# EasyEDA schematic SCH_FILTER_SOL_01_2025-06-17.json
TITLE: PUMP-FP-101_SCH; REV: 1.0; Date: 2025-04-23; Sheet: 1/1; Drawn By: aamirf; Company: FARMINCLOUD
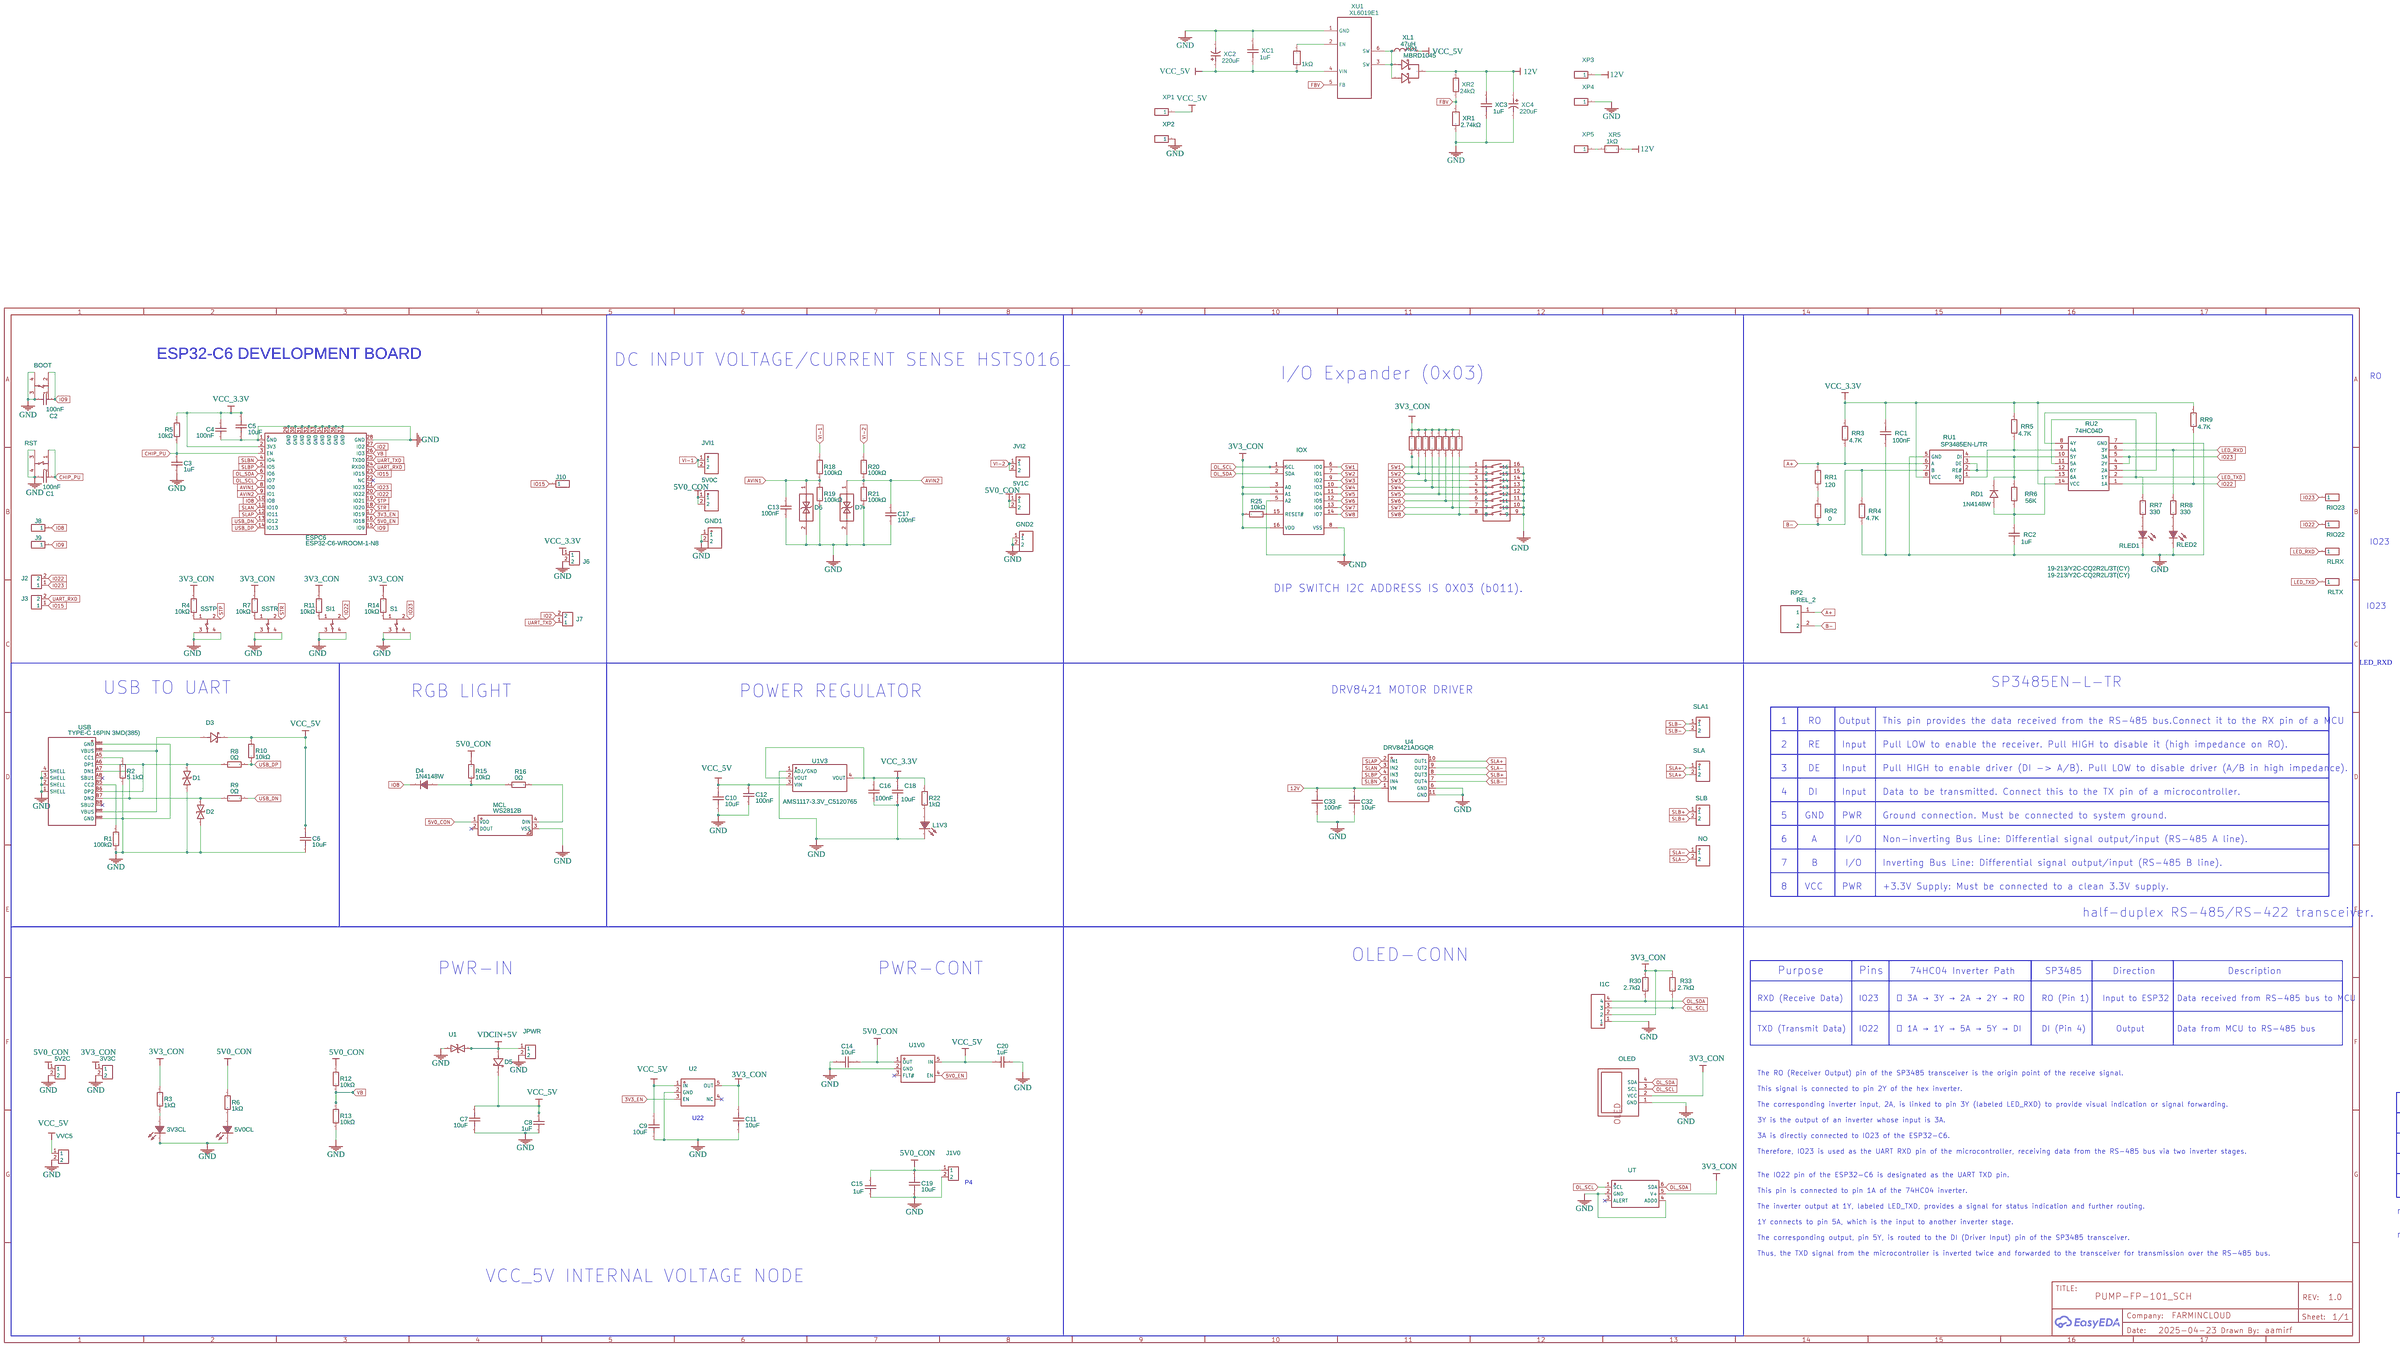
[diagram p0: schematic sheet]

## Parts
3V3C  HD_1X2_2.54  [HDR-TH_2P-P2.54]
3V3CL  KT-0603R  [LED0603-RD]
5V0C  2060-451/998-404  [CONN-SMD_L12.7-W3.9_2060-451-998-404]
5V0CL  KT-0603R  [LED0603-RD]
5V1C  2060-471/998-404  [CONN-SMD_L12.7-W3.9_2060-451-998-404]
5V2C  HD_1X2_2.54  [HDR-TH_2P-P2.54]
BOOT  TS-1102SD-A-Q-R  [SW-SMD_4P-L6.0-W6.0-P4.50-LS9.2]
C1  100nF  [C0805]
C2  100nF  [C0805]
C3  1uF  [C0805]
C4  100nF  [C0805]
C5  10uF  [C0805]
C6  10uF  [C0805]
C7  10uF  [C0805]
C8  1uF  [C0805]
C9  10uF  [C0805]
C10  10uF  [C0805]
C11  10uF  [C0805]
C12  100nF  [C0805]
C13  100nF  [C0805]
C14  10uF  [C0805]
C15  1uF  [C0805]
C16  100nF  [C0805]
C17  100nF  [C0805]
C18  10uF  [C0805]
C19  10uF  [C0805]
C20  1uF  [C0805]
C32  10uF  [C0805]
C33  100nF  [C0805]
D1  LESD5D5.0CT1G  [SOD-523_L1.2-W0.8-LS1.6-BI]
D2  LESD5D5.0CT1G  [SOD-523_L1.2-W0.8-LS1.6-BI]
D3  K1N5819HW-7-F  [SOD-123_L2.7-W1.6-LS3.7-FD]
D4  1N4148W  [SOD-123_L2.8-W1.8-LS3.7-RD]
D5  K1N5819HW-7-F  [SOD-123_L2.7-W1.6-LS3.7-FD]
D6  KESD5311X  [D0402-BI]
D7  KESD5311X  [D0402-BI]
ESPC6  ESP32-C6-WROOM-1-N8  [WIRELM-SMD_ESP32-C6-WROOM-1]
GND1  2060-451/998-404  [CONN-SMD_L12.7-W3.9_2060-451-998-404]
GND2  2060-451/998-404  [CONN-SMD_L12.7-W3.9_2060-451-998-404]
I1C  X6511WV-04H-C30D60  [HDR-TH_4P-P2.54-V-M]
IOS  THS108J  [SW-SMD_16P-L11.7-W5.6-P1.27-LS5.6]
IOX  PCA9557PW,118  [TSSOP-16_L5.0-W4.4-P0.65-LS6.4-BL]
J1V0  HD_1X2_2.54  [HDR-TH_2P-P2.54]
J2  HD_1X2_2.54  [HDR-TH_2P-P2.54]
J3  HD_1X2_2.54  [HDR-TH_2P-P2.54]
J6  HD_1X2_2.54  [HDR-TH_2P-P2.54]
J7  HD_1X2_2.54  [HDR-TH_2P-P2.54]
J8  HDR-M-2.54_1x1  [HDR-M-2.54_1X1]
J9  HDR-M-2.54_1x1  [HDR-M-2.54_1X1]
J10  HDR-M-2.54_1x1  [HDR-M-2.54_1X1]
JPWR  HD_1X2_2.54  [HDR-TH_2P-P2.54]
JVI1  2060-451/998-404  [CONN-SMD_L12.7-W3.9_2060-451-998-404]
JVI2  2060-451/998-404  [CONN-SMD_L12.7-W3.9_2060-451-998-404]
L1V3  KT-0603R  [LED0603-RD]
MCL  WS2812B  [LED-SMD_4P-L5.0-W5.0-TL]
NO  2060-451/998-404  [CONN-SMD_L12.7-W3.9_2060-451-998-404]
OLED  GRINNAN_OLED 128X64 0,96" I2C 4PIN  [I2C - OLED 0.96" 128X64]
R1  100kΩ  [R0805]
R2  5.1kΩ  [R0805]
R3  1kΩ  [R0805]
R4  10kΩ  [R0805]
R5  10kΩ  [R0805]
R6  1kΩ  [R0805]
R7  10kΩ  [R0805]
R8  0Ω  [R0805]
R9  0Ω  [R0805]
R10  10kΩ  [R0805]
R11  10kΩ  [R0805]
R12  10kΩ  [R0805]
R13  10kΩ  [R0805]
R14  10kΩ  [R0805]
R15  10kΩ  [R0805]
R16  0Ω  [R0805]
R18  100kΩ  [R0805]
R19  100kΩ  [R0805]
R20  100kΩ  [R0805]
R21  100kΩ  [R0805]
R22  1kΩ  [R0805]
R25  10kΩ  [R0805]
R30  2.7kΩ  [R0805]
R33  2.7kΩ  [R0805]
RC1  100nF  [C0603]
RC2  1uF  [C0603]
RD1  1N4148W  [SOD-123_L2.8-W1.8-LS3.7-RD]
RIO22  Header-Male-2.54_1x1  [HDR-TH_1P-P2.54-V-M]
RIO23  Header-Male-2.54_1x1  [HDR-TH_1P-P2.54-V-M]
RLED1  19-213/Y2C-CQ2R2L/3T(CY)  [LED0603-R-RD]
RLED2  19-213/Y2C-CQ2R2L/3T(CY)  [LED0603-R-RD]
RLRX  Header-Male-2.54_1x1  [HDR-TH_1P-P2.54-V-M]
RLTX  Header-Male-2.54_1x1  [HDR-TH_1P-P2.54-V-M]
RP2  REL_2  [CONN-TH_2P-P5.00_WJ300V-5.00-2P]
RR1  120  [R0603]
RR2  0  [R0603]
RR3  4.7K  [R0603]
RR4  4.7K  [R0603]
RR5  4.7K  [R0603]
RR6  56K  [R0603]
RR7  330  [R0603]
RR8  330  [R0603]
RR9  4.7K  [R0603]
RST  TS-1102SD-A-Q-R  [SW-SMD_4P-L6.0-W6.0-P4.50-LS9.2]
RU1  SP3485EN-L/TR  [SOIC-8_L5.0-W4.0-P1.27-LS6.0-BL]
RU2  74HC04D  [SOIC-14_150MIL]
S1  TS-1102SD-A-Q-R  [SW-SMD_4P-L6.0-W6.0-P4.50-LS9.2]
S2  10kΩ  [R0402]
S3  10kΩ  [R0402]
S4  10kΩ  [R0402]
S5  10kΩ  [R0402]
S6  10kΩ  [R0402]
S7  10kΩ  [R0402]
S8  10kΩ  [R0402]
S9  10kΩ  [R0402]
SI1  TS-1102SD-A-Q-R  [SW-SMD_4P-L6.0-W6.0-P4.50-LS9.2]
SLA  2060-451/998-404  [CONN-SMD_L12.7-W3.9_2060-451-998-404]
SLA1  2060-451/998-404  [CONN-SMD_L12.7-W3.9_2060-451-998-404]
SLB  2060-451/998-404  [CONN-SMD_L12.7-W3.9_2060-451-998-404]
SSTP  TS-1102SD-A-Q-R  [SW-SMD_4P-L6.0-W6.0-P4.50-LS9.2]
SSTR  TS-1102SD-A-Q-R  [SW-SMD_4P-L6.0-W6.0-P4.50-LS9.2]
U1  LESD5D5.0CT1G_C5246195  [SOD-523_L1.2-W0.8-LS1.6-BI]
U1V0  TPS2065DDBVR  [SOT-23-5_L3.0-W1.7-P0.95-LS2.8-BL]
U1V3  AMS1117-3.3V_C5120765  [SOT-223-4_L6.5-W3.5-P2.30-LS7.0-TR]
U2  TLV75533PDBVR  [SOT-23-5_L3.0-W1.7-P0.95-LS2.8-BR]
U4  DRV8421ADGQR  [HVSSOP-10_L3.0-W3.0-P0.50-LS4.9-BL-EP]
USB  TYPE-C 16PIN 3MD(385)  [USB-C-SMD_TYPE-C16PIN]
UT  TMP112BIDRLR_C3019123  [SOT-563_L1.6-W1.2-P0.50-LS1.6-BR]
VVC5  HD_1X2_2.54  [HDR-TH_2P-P2.54]
XC1  1uF  [C0805]
XC2  220uF  [CAP-SMD_BD6.3-L6.6-W6.6-LS7.4-FD]
XC3  1uF  [C0805]
XC4  220uF  [CAP-SMD_BD6.3-L6.6-W6.6-LS7.4-FD]
XD1  MBRD1045  [TO-252-3_L6.5-W5.9-P4.60-LS10.0-BL]
XL1  47uH  [IND-SMD_L11.0-W10.5_SL1050-330M]
XP1  Header-Male-2.54_1x1  [HDR-TH_1P-P2.54-V-M]
XP2  Header-Male-2.54_1x1  [HDR-TH_1P-P2.54-V-M]
XP3  Header-Male-2.54_1x1  [HDR-TH_1P-P2.54-V-M]
XP4  Header-Male-2.54_1x1  [HDR-TH_1P-P2.54-V-M]
XP5  Header-Male-2.54_1x1  [HDR-TH_1P-P2.54-V-M]
XR1  2.74kΩ  [R0805]
XR2  24kΩ  [R0805]
XR3  1kΩ  [R0805]
XR5  1kΩ  [R0805]
XU1  XL6019E1  [TO-263-5_L10.2-W9.9-P1.70-LS14.4-TL]

## Library data of the parts
3V3C 5V2C J1V0 J2 J3 J6 J7 JPWR VVC5 = HD_1X2_2.54: Supplier: AAF; Contributor: aamirf
3V3CL 5V0CL L1V3 = KT-0603R: Supplier: LCSC; Manufacturer: KENTO; Supplier Part: C2286; JLCPCB Part Class: Basic Part
5V0C 5V1C GND1 GND2 JVI1 JVI2 NO SLA SLA1 SLB = 2060-451/998-404: Contributor: LCSC; Supplier: LCSC; Supplier Part: C2765054; Manufacturer: WAGO(万可); JLCPCB Part Class: Extended Part
BOOT RST S1 SI1 SSTP SSTR = TS-1102SD-A-Q-R: Contributor: lcsc; Supplier: LCSC; Supplier Part: C3010217; Manufacturer: XKB Connectivity(中国星坤)
C1 C2 C4 C12 C13 C16 C17 = CL21B104KCFNNNE: Supplier: LCSC; Manufacturer: SAMSUNG(三星); Supplier Part: C28233; JLCPCB Part Class: Basic Part
C3 C8 C15 C20 = CL21B105KBFNNNE: Supplier: LCSC; Manufacturer: SAMSUNG(三星); Supplier Part: C28323; JLCPCB Part Class: Basic Part
C5-C7 C9-C11 C14 C18 C19 = CL21A106KAYNNNE: Supplier: LCSC; Manufacturer: SAMSUNG(三星); Supplier Part: C15850; JLCPCB Part Class: Basic Part
C32 = CGA4J1X7R0J106M125AD: Contributor: lcsc; Supplier: LCSC; Supplier Part: C3840859; Manufacturer: TDK
C33 = CGA4J3X7T2E104K125AA_C5331016: Contributor: lcsc; Supplier: LCSC; Supplier Part: C5331016; Manufacturer: TDK; Manufacturer Part: CGA4J3X7T2E104K125AA; JLCPCB Part Class: Extended Part
D1 D2 = LESD5D5.0CT1G: Contributor: LCSC; Supplier: LCSC; Supplier Part: C383211; Manufacturer: LRC(乐山无线电); JLCPCB Part Class: Extended Part
D3 D5 = K1N5819HW-7-F: Contributor: LCSC; Supplier: LCSC; Supplier Part: C2891704; Manufacturer: KUU; JLCPCB Part Class: Extended Part
D4 = 1N4148W: Contributor: LCSC; Supplier: LCSC; Manufacturer: HT(金誉); Supplier Part: C179717; JLCPCB Part Class: Extended Part
D6 D7 = KESD5311X: Contributor: lcsc; Supplier: LCSC; Supplier Part: C2892495; Manufacturer: KUU; JLCPCB Part Class: Extended Part
ESPC6 = ESP32-C6-WROOM-1-N8: Supplier: LCSC; Supplier Part: C5366877; Manufacturer: ESPRESSIF(乐鑫); Contributor: lcsc; JLCPCB Part Class: Extended Part
I1C = X6511WV-04H-C30D60: Contributor: LCSC; Supplier: LCSC; Supplier Part: C706876; Manufacturer: XKB Connectivity(中国星坤); JLCPCB Part Class: Extended Part
IOS = THS108J: Supplier: LCSC; Supplier Part: C2758169; Manufacturer: ROCPU Switches(台普); JLCPCB Part Class: Extended Part; Contributor: lcsc
IOX = PCA9557PW,118: Contributor: LCSC; Supplier: LCSC; Manufacturer: NXP(恩智浦); Supplier Part: C141380; JLCPCB Part Class: Extended Part
J8-J10 = HDR-M-2.54_1x1: Supplier Part: C81276; Supplier: LCSC; Contributor: LCEDA_Lib
MCL = WS2812B: Contributor: LCSC; Supplier: LCSC; Manufacturer: worldsemi; Manufacturer Part: WS2812B-V3; Supplier Part: C114585
OLED = GRINNAN_OLED 128X64 0,96" I2C 4PIN: Manufacturer Part: SSD1306 I2C OLED; Contributor: alexvoicea_91
R1 R18-R21 = 0805W8F1003T5E_C149504: Contributor: LCSC; Supplier: LCSC; Supplier Part: C149504; Manufacturer: UNI-ROYAL(厚声); Manufacturer Part: 0805W8F1003T5E; JLCPCB Part Class: Basic Part
R2 = 0805W8F5101T5E: Supplier: LCSC; Manufacturer: UNI-ROYAL(厚声); Supplier Part: C27834; JLCPCB Part Class: Basic Part
R3 R6 R22 = 0805W8F1001T5E: Supplier: LCSC; Manufacturer: UNI-ROYAL(厚声); Supplier Part: C17513; JLCPCB Part Class: Basic Part
R4 R5 R7 R10-R15 R25 = 0805W8F1002T5E: Supplier: LCSC; Manufacturer: UNI-ROYAL(厚声); Supplier Part: C17414; JLCPCB Part Class: Basic Part
R8 R9 R16 = 0805W8F0000T5E: Supplier: LCSC; Manufacturer: UNI-ROYAL(厚声); Supplier Part: C17477; JLCPCB Part Class: Basic Part
R30 R33 = 0805W8F2701T5E: Supplier: LCSC; Manufacturer: UNI-ROYAL(厚声); Supplier Part: C17530; JLCPCB Part Class: Basic Part
RC1 = CC0603KRX7R9BB104: Supplier: LCSC; Manufacturer: YAGEO; LCSC Assembly: Yes; Supplier Part: C14663; SMT Type: Basic
RC2 = CL10A105KB8NNNC: Supplier: LCSC; Manufacturer: SAMSUNG; LCSC Assembly: Yes; Supplier Part: C15849; SMT Type: Basic
RD1 = 1N4148W_C81598: Supplier: LCSC; Manufacturer: SEMTECH; image: //image.lceda.cn/szlcsc/C81598.jpg; Supplier Part: C81598; LCSC Assembly: Yes; SMT Type: Basic
RIO22 RIO23 RLRX RLTX XP1-XP5 = Header-Male-2.54_1x1: Supplier: LCSC; Manufacturer: BOOMELE(博穆精密); Manufacturer Part: 2.54-1*1P针; Supplier Part: C81276; JLCPCB Part Class: Extended Part
RLED1 RLED2 = 19-213/Y2C-CQ2R2L/3T(CY): Supplier: LCSC; Manufacturer: EVERLIGHT; LCSC Assembly: Yes; image: //image.lceda.cn/szlcsc/C72038.jpg; Supplier Part: C72038; SMT Type: Basic
RP2 = WJ300V-5.0-2P: Supplier: LCSC; Manufacturer: KANGNEX(康奈克斯电气); Supplier Part: C8385; JLCPCB Part Class: Extended Part
RR1 = 0603WAF1200T5E: Supplier: LCSC; Manufacturer: UniOhm; LCSC Assembly: Yes; Supplier Part: C22787; SMT Type: Basic
RR2 = 0603WAF0000T5E: Supplier: LCSC; Manufacturer: UniOhm; LCSC Assembly: Yes; Supplier Part: C21189; SMT Type: Basic
RR3-RR5 RR9 = 0603WAF4701T5E: Supplier: LCSC; Manufacturer: UniOhm; LCSC Assembly: Yes; Supplier Part: C23162; SMT Type: Basic
RR6 = 0603WAF5602T5E: Supplier: LCSC; Manufacturer: UniOhm; LCSC Assembly: Yes; Supplier Part: C23206; SMT Type: Basic
RR7 RR8 = 0603WAF3300T5E: Supplier: LCSC; Manufacturer: UniOhm; LCSC Assembly: Yes; Supplier Part: C23138; SMT Type: Basic
RU1 = SP3485EN-L/TR: Supplier: LCSC; Manufacturer: EXAR; LCSC Assembly: Yes; image: //image.lceda.cn/szlcsc/C8963.jpg; Supplier Part: C8963; SMT Type: Basic
RU2 = -: Supplier: LCSC; Manufacturer: Nexperia; Manufacturer Part: 74HC04D,653; LCSC Assembly: Yes; image: //image.lceda.cn/szlcsc/C5590.jpg; Supplier Part: C5590; SMT Type: Basic
S2-S9 = 0402WGF1002TCE: Supplier: LCSC; Manufacturer: UNI-ROYAL(厚声); Supplier Part: C25744; JLCPCB Part Class: Basic Part; link: https://lcsc.com/eda_search?q=C25744&%26type=1&ref=editor; Package Display: No
U1 = LESD5D5.0CT1G_C5246195: Contributor: lcsc; Supplier: LCSC; Supplier Part: C5246195; Manufacturer: Leiditech(雷卯电子); Manufacturer Part: LESD5D5.0CT1G
U1V0 = TPS2065DDBVR: Contributor: LCSC; Supplier: LCSC; Supplier Part: C414625; Manufacturer: TI(德州仪器); JLCPCB Part Class: Extended Part
U1V3 = AMS1117-3.3V_C5120765: Supplier: LCSC; Supplier Part: C5120765; Manufacturer: MSKSEMI(美森科); Manufacturer Part: AMS1117-3.3V; Contributor: lcsc; JLCPCB Part Class: Extended Part
U2 = TLV75533PDBVR: Contributor: LCSC; Supplier: LCSC; Supplier Part: C404027; Manufacturer: TI(德州仪器); JLCPCB Part Class: Extended Part
U4 = DRV8421ADGQR: Supplier: LCSC; Supplier Part: C39991458; Manufacturer: TI(德州仪器); JLCPCB Part Class: Extended Part; Contributor: lcsc
USB = TYPE-C 16PIN 3MD(385): Contributor: LCSC; Supplier: LCSC; Supplier Part: C2858270; Manufacturer: SHOU HAN(首韩); JLCPCB Part Class: Extended Part
UT = TMP112BIDRLR_C3019123: Contributor: lcsc; Supplier: LCSC; Supplier Part: C3019123; Manufacturer: UMW(友台半导体); Manufacturer Part: TMP112BIDRLR; JLCPCB Part Class: Extended Part
XC1 XC3 = 0805B105M500NT: Contributor: lcsc; Supplier: LCSC; Supplier Part: C2913555; Manufacturer: FH(风华); JLCPCB Part Class: Extended Part
XC2 XC4 = JBLM2221M025C090RTM 220UF 25V: Supplier: LCSC; Supplier Part: C19270707; Manufacturer: DMBJ(振宝佳); Contributor: lcsc; JLCPCB Part Class: Extended Part
XD1 = MBRD1045: Supplier: LCSC; Supplier Part: C5137764; Manufacturer: GOODWORK(固得沃克); JLCPCB Part Class: Extended Part; Contributor: lcsc
XL1 = SL1050-470M: Supplier: LCSC; Supplier Part: C22463846; Manufacturer: 台湾陆海; JLCPCB Part Class: Extended Part; Contributor: lcsc
XR1 = PTFR0805B2K74P9: Supplier: LCSC; Supplier Part: C2849159; Manufacturer: RESI(开步睿思); JLCPCB Part Class: Extended Part; Contributor: lcsc
XR2 = CR0805-FX-2402ELF: Contributor: LCSC; Supplier: LCSC; Supplier Part: C204332; Manufacturer: BOURNS; JLCPCB Part Class: Extended Part
XR3 = SC0805J1001F4ANRH: Contributor: lcsc; Supplier: LCSC; Supplier Part: C3152222; Manufacturer: Sunway(信维通信); JLCPCB Part Class: Extended Part
XR5 = TP0805T1K00P0505Z: Supplier: LCSC; Supplier Part: C5184168; Manufacturer: EVER OHMS(天二科技); JLCPCB Part Class: Extended Part; Contributor: lcsc
XU1 = XL6019E1: Supplier: LCSC; Manufacturer: XLSEMI(芯龙); Supplier Part: C73018; JLCPCB Part Class: Extended Part

## Nets
3V3_CON: 3V3C.1 C11.1 I1C.2 IOX.3(A0) IOX.4(A1) IOX.16(VDD) OLED.2(VCC) R3.1 R4.1 R7.1 R11.1 R14.1 R25.2 R30.1 R33.1 S2.2 S3.2 S4.2 S5.2 S6.2 S7.2 S8.2 S9.2 U2.5(OUT) UT.5(V+)
3V3_EN: ESPC6.17(IO19) U2.3(EN)
5V0_CON: 5V0C.1 5V0C.2 5V1C.1 5V1C.2 5V2C.1 C14.2 C15.1 C19.1 J1V0.1 MCL.1(VDD) R6.1 R12.1 R15.1 U1V0.1(OUT)
5V0_EN: ESPC6.16(IO18) U1V0.4(EN)
12V: C32.2 C33.2 U4.1(VM) XC3.2 XC4.1 XD1.2(K) XP3.1 XR2.2 XR5.2
AVIN1: C13.1 D6.1 ESPC6.8(IO0) R18.2 R19.1
AVIN2: C17.1 D7.1 ESPC6.9(IO1) R20.2 R21.1
GND: 3V3C.2 3V3CL.1(K) 5V0CL.1(K) 5V2C.2 BOOT.3 BOOT.4 C1.2 C2.1 C3.2 C4.2 C5.2 C6.2 C7.2 C8.2 C9.2 C10.2 C11.2 C12.2 C13.2 C14.1 C15.2 C16.2 C17.2 C18.2 C19.2 C20.1 C32.1 C33.1 D1.1 D2.1 D6.2 D7.2 ESPC6.1(GND) ESPC6.28(GND) ESPC6.29(GND) ESPC6.30(GND) ESPC6.31(GND) ESPC6.32(GND) ESPC6.33(GND) ESPC6.34(GND) ESPC6.35(GND) ESPC6.36(GND) ESPC6.37(GND) GND1.1 GND1.2 GND2.1 GND2.2 I1C.1 IOS.9 IOS.10 IOS.11 IOS.12 IOS.13 IOS.14 IOS.15 IOS.16 IOX.5(A2) IOX.8(VSS) J1V0.2 J6.2 JPWR.2 L1V3.1(K) MCL.3(VSS) OLED.1(GND) R1.2 R2.2 R13.2 R19.2 R21.2 RC1.1 RC2.1 RLED1.2(C) RLED2.2(C) RR4.1 RST.3 RST.4 RU1.5(GND) RU2.7(GND) S1.3 S1.4 SI1.3 SI1.4 SSTP.3 SSTP.4 SSTR.3 SSTR.4 U1.1 U1V0.2(GND) U1V3.1(ADJ/GND) U2.2(GND) U4.6(GND) U4.11(GND) USB.1(SHELL) USB.2(SHELL) USB.3(SHELL) USB.4(SHELL) USB.A1B12(GND) USB.B1A12(GND) UT.2(GND) UT.4(ADD0) VVC5.2 XC1.2 XC2.2 XC3.1 XC4.2 XP2.1 XP4.1 XR1.1 XU1.1(GND)
VCC_3.3V: C4.1 C5.1 C16.1 C18.1 ESPC6.2(3V3) J6.1 R5.1 R22.1 RC1.2 RR3.2 RR5.2 RR9.2 RU1.8(VCC) RU2.14(VCC) U1V3.2(VOUT) U1V3.4(VOUT)
VCC_5V: C6.1 C7.1 C8.1 C9.1 C10.1 C12.1 C20.2 D3.2(K) D5.2(K) R10.1 U1V0.5(IN) U1V3.3(VIN) U2.1(IN) VVC5.1 XC1.1 XC2.1 XL1.2 XP1.1 XR3.1 XU1.4(VIN)
A+: RP2.1 RR1.1 RR3.1 RU1.6(A)
B-: RP2.2 RR2.2 RR4.2 RU1.7(B)
CHIP_PU: C1.1 C3.1 ESPC6.3(EN) R5.2 RST.1 RST.2
FBV: XR1.2 XR2.1 XU1.5(FB)
IO2: ESPC6.27(IO2) J7.2
IO8: D4.1(K) ESPC6.10(IO8) J8.1
IO9: BOOT.1 BOOT.2 C2.2 ESPC6.15(IO9) J9.1
IO15: ESPC6.23(IO15) J3.1 J10.1
IO22: ESPC6.20(IO22) J2.2 RIO22.1 RR9.1 RU2.1(1A) SI1.2
IO23: ESPC6.21(IO23) J2.1 RIO23.1 RU2.4(2Y) RU2.5(3A) S1.2
LED_RXD: RLRX.1 RR8.1 RU2.6(3Y)
LED_TXD: RLTX.1 RR7.2 RU2.2(1Y) RU2.11(5A)
OL_SCL: ESPC6.7(IO7) I1C.3 IOX.1(SCL) OLED.3(SCL) R33.2 UT.1(SCL)
OL_SDA: ESPC6.6(IO6) I1C.4 IOX.2(SDA) OLED.4(SDA) R30.2 UT.6(SDA)
SLA+: SLA.1 SLA.2 U4.10(OUT1)
SLA-: NO.1 NO.2 U4.9(OUT2)
SLAN: ESPC6.11(IO10) U4.3(IN2)
SLAP: ESPC6.12(IO11) U4.2(IN1)
SLB+: SLB.1 SLB.2 U4.8(OUT3)
SLB-: SLA1.1 SLA1.2 U4.7(OUT4)
SLBN: ESPC6.4(IO4) U4.5(IN4)
SLBP: ESPC6.5(IO5) U4.4(IN3)
STP: ESPC6.19(IO21) SSTP.2
STR: ESPC6.18(IO20) SSTR.2
SW1: IOS.1 IOX.6(IO0) S2.1
SW2: IOS.2 IOX.7(IO1) S3.1
SW3: IOS.3 IOX.9(IO2) S4.1
SW4: IOS.4 IOX.10(IO3) S5.1
SW5: IOS.5 IOX.11(IO4) S6.1
SW6: IOS.6 IOX.12(IO5) S7.1
SW7: IOS.7 IOX.13(IO6) S8.1
SW8: IOS.8 IOX.14(IO7) S9.1
UART_RXD: ESPC6.24(RXD0) J3.2
UART_TXD: ESPC6.25(TXD0) J7.1
USB_DN: ESPC6.13(IO12) R9.2
USB_DP: ESPC6.14(IO13) R8.2 R10.2
VB: ESPC6.26(IO3) R12.2 R13.1
VDCIN+5V: D5.1(A) JPWR.1 U1.2
VI-1: JVI1.1 JVI1.2 R18.1
VI-2: JVI2.1 JVI2.2 R20.1
Net-(3V3CL-2): 3V3CL.2(A) R3.2
Net-(5V0CL-2): 5V0CL.2(A) R6.2
Net-(D1-2): D1.2 R8.1 USB.A6(DP1) USB.B6(DP2)
Net-(D2-2): D2.2 R9.1 USB.A7(DN1) USB.B7(DN2)
Net-(D3-1): D3.1(A) USB.A4B9(VBUS) USB.B4A9(VBUS)
Net-(D4-2): D4.2(A) R15.2 R16.1
Net-(IOX-15): IOX.15(RESET#) R25.1
Net-(L1V3-2): L1V3.2(A) R22.2
Net-(MCL-4): MCL.4(DIN) R16.2
Net-(R1-1): R1.1 USB.B5(CC2)
Net-(R2-1): R2.1 USB.A5(CC1)
Net-(R4-2): R4.2 SSTP.1
Net-(R7-2): R7.2 SSTR.1
Net-(R11-2): R11.2 SI1.1
Net-(R14-2): R14.2 S1.1
Net-(RC2-2): RC2.2 RD1.2(A) RR6.1 RU2.13(6A)
Net-(RD1-1): RD1.1(K) RR6.2 RU1.4(DI) RU2.10(5Y)
Net-(RLED1-1): RLED1.1(A) RR7.1
Net-(RLED2-1): RLED2.1(A) RR8.2
Net-(RR1-2): RR1.2 RR2.1
Net-(RR5-1): RR5.1 RU1.1(RO) RU2.9(4A)
Net-(RU1-2): RU1.2(RE#) RU1.3(DE) RU2.12(6Y)
Net-(RU2-3): RU2.3(2A) RU2.8(4Y)
Net-(XD1-1): XD1.1(A) XD1.3(A) XL1.1 XU1.3(SW) XU1.6(SW)
Net-(XP5-1): XP5.1 XR5.1
Net-(XR3-2): XR3.2 XU1.2(EN)

Not connected (* = marked no-connect by the designer): ESPC6 22(NC)*; MCL 2(DOUT)*; U1V0 3(FLT#)*; U2 4(NC)*; USB A8(SBU1)* B8(SBU2)*; UT 3(ALERT)*

## Notes on the sheet
- ESP32-C6 DEVELOPMENT BOARD
- DC INPUT VOLTAGE/CURRENT SENSE HSTS016L
- I/O Expander (0x03)
- RO
- 4A
- 4Y
- 2A
- IO23
- 2Y
- DIP SWITCH I2C ADDRESS IS 0X03 (b011).
- IO23
- 3A
- LED_RXD
- 3Y
- USB TO UART
- RGB LIGHT
- POWER REGULATOR
- SP3485EN-L-TR
- DRV8421 MOTOR DRIVER
- 1
- RO
- Output
- This pin provides the data received from the RS-485 bus.Connect it to the RX pin of a MCU
- 2
- RE
- Input
- Pull LOW to enable the receiver. Pull HIGH to disable it (high impedance on RO).
- 3
- DE
- Input
- Pull HIGH to enable driver (DI -> A/B). Pull LOW to disable driver (A/B in high impedance).
- 4
- DI
- Input
- Data to be transmitted. Connect this to the TX pin of a microcontroller.
- 5
- GND
- PWR
- Ground connection. Must be connected to system ground.
- 6
- A
- I/O
- Non-inverting Bus Line: Differential signal output/input (RS-485 A line).
- 7
- B
- I/O
- Inverting Bus Line: Differential signal output/input (RS-485 B line).
- 8
- VCC
- PWR
- +3.3V Supply: Must be connected to a clean 3.3V supply.
- half-duplex RS-485/RS-422 transceiver.
- OLED-CONN
- PWR-IN
- PWR-CONT
- Purpose
- Pins
- 74HC04 Inverter Path
- SP3485
- Direction
- Description
- RXD (Receive Data)
- IO23
- ➤ 3A → 3Y → 2A → 2Y → RO
- RO (Pin 1)
- Input to ESP32
- Data received from RS-485 bus to MCU
- TXD (Transmit Data)
- IO22
- ➤ 1A → 1Y → 5A → 5Y → DI
- DI (Pin 4)
- Output
- Data from MCU to RS-485 bus
- 74HC04 Pin Functions (Hex Inverter)
- The RO (Receiver Output) pin of the SP3485 transceiver is the origin point of the receive signal.
  This signal is connected to pin 2Y of the hex inverter.
  The corresponding inverter input, 2A, is linked to pin 3Y (labeled LED_RXD) to provide visual indication or signal forwarding.
  3Y is the output of an inverter whose input is 3A.
  3A is directly connected to IO23 of the ESP32-C6.
  Therefore, IO23 is used as the UART RXD pin of the microcontroller, receiving data from the RS-485 bus via two inverter stages.
  The IO22 pin of the ESP32-C6 is designated as the UART TXD pin.
  This pin is connected to pin 1A of the 74HC04 inverter.
  The inverter output at 1Y, labeled LED_TXD, provides a signal for status indication and further routing.
  1Y connects to pin 5A, which is the input to another inverter stage.
  The corresponding output, pin 5Y, is routed to the DI (Driver Input) pin of the SP3485 transceiver.
  Thus, the TXD signal from the microcontroller is inverted twice and forwarded to the transceiver for transmission over the RS-485 bus.
- Pin
- Name
- Type
- Description
- U22
- 1.
- 1A
- Input
- Inverter 1 Input
- 2.
- 1Y
- Output
- Inverter 1 Output
- 3.
- 2A
- Input
- Inverter 2 Input
- P4
- 4.
- 2Y
- Output
- Inverter 2 Output
- nA => Input
- nY => Output
- VCC_5V INTERNAL VOLTAGE NODE
